# Altium schematic sheet Sheet1.SchDoc
size A3
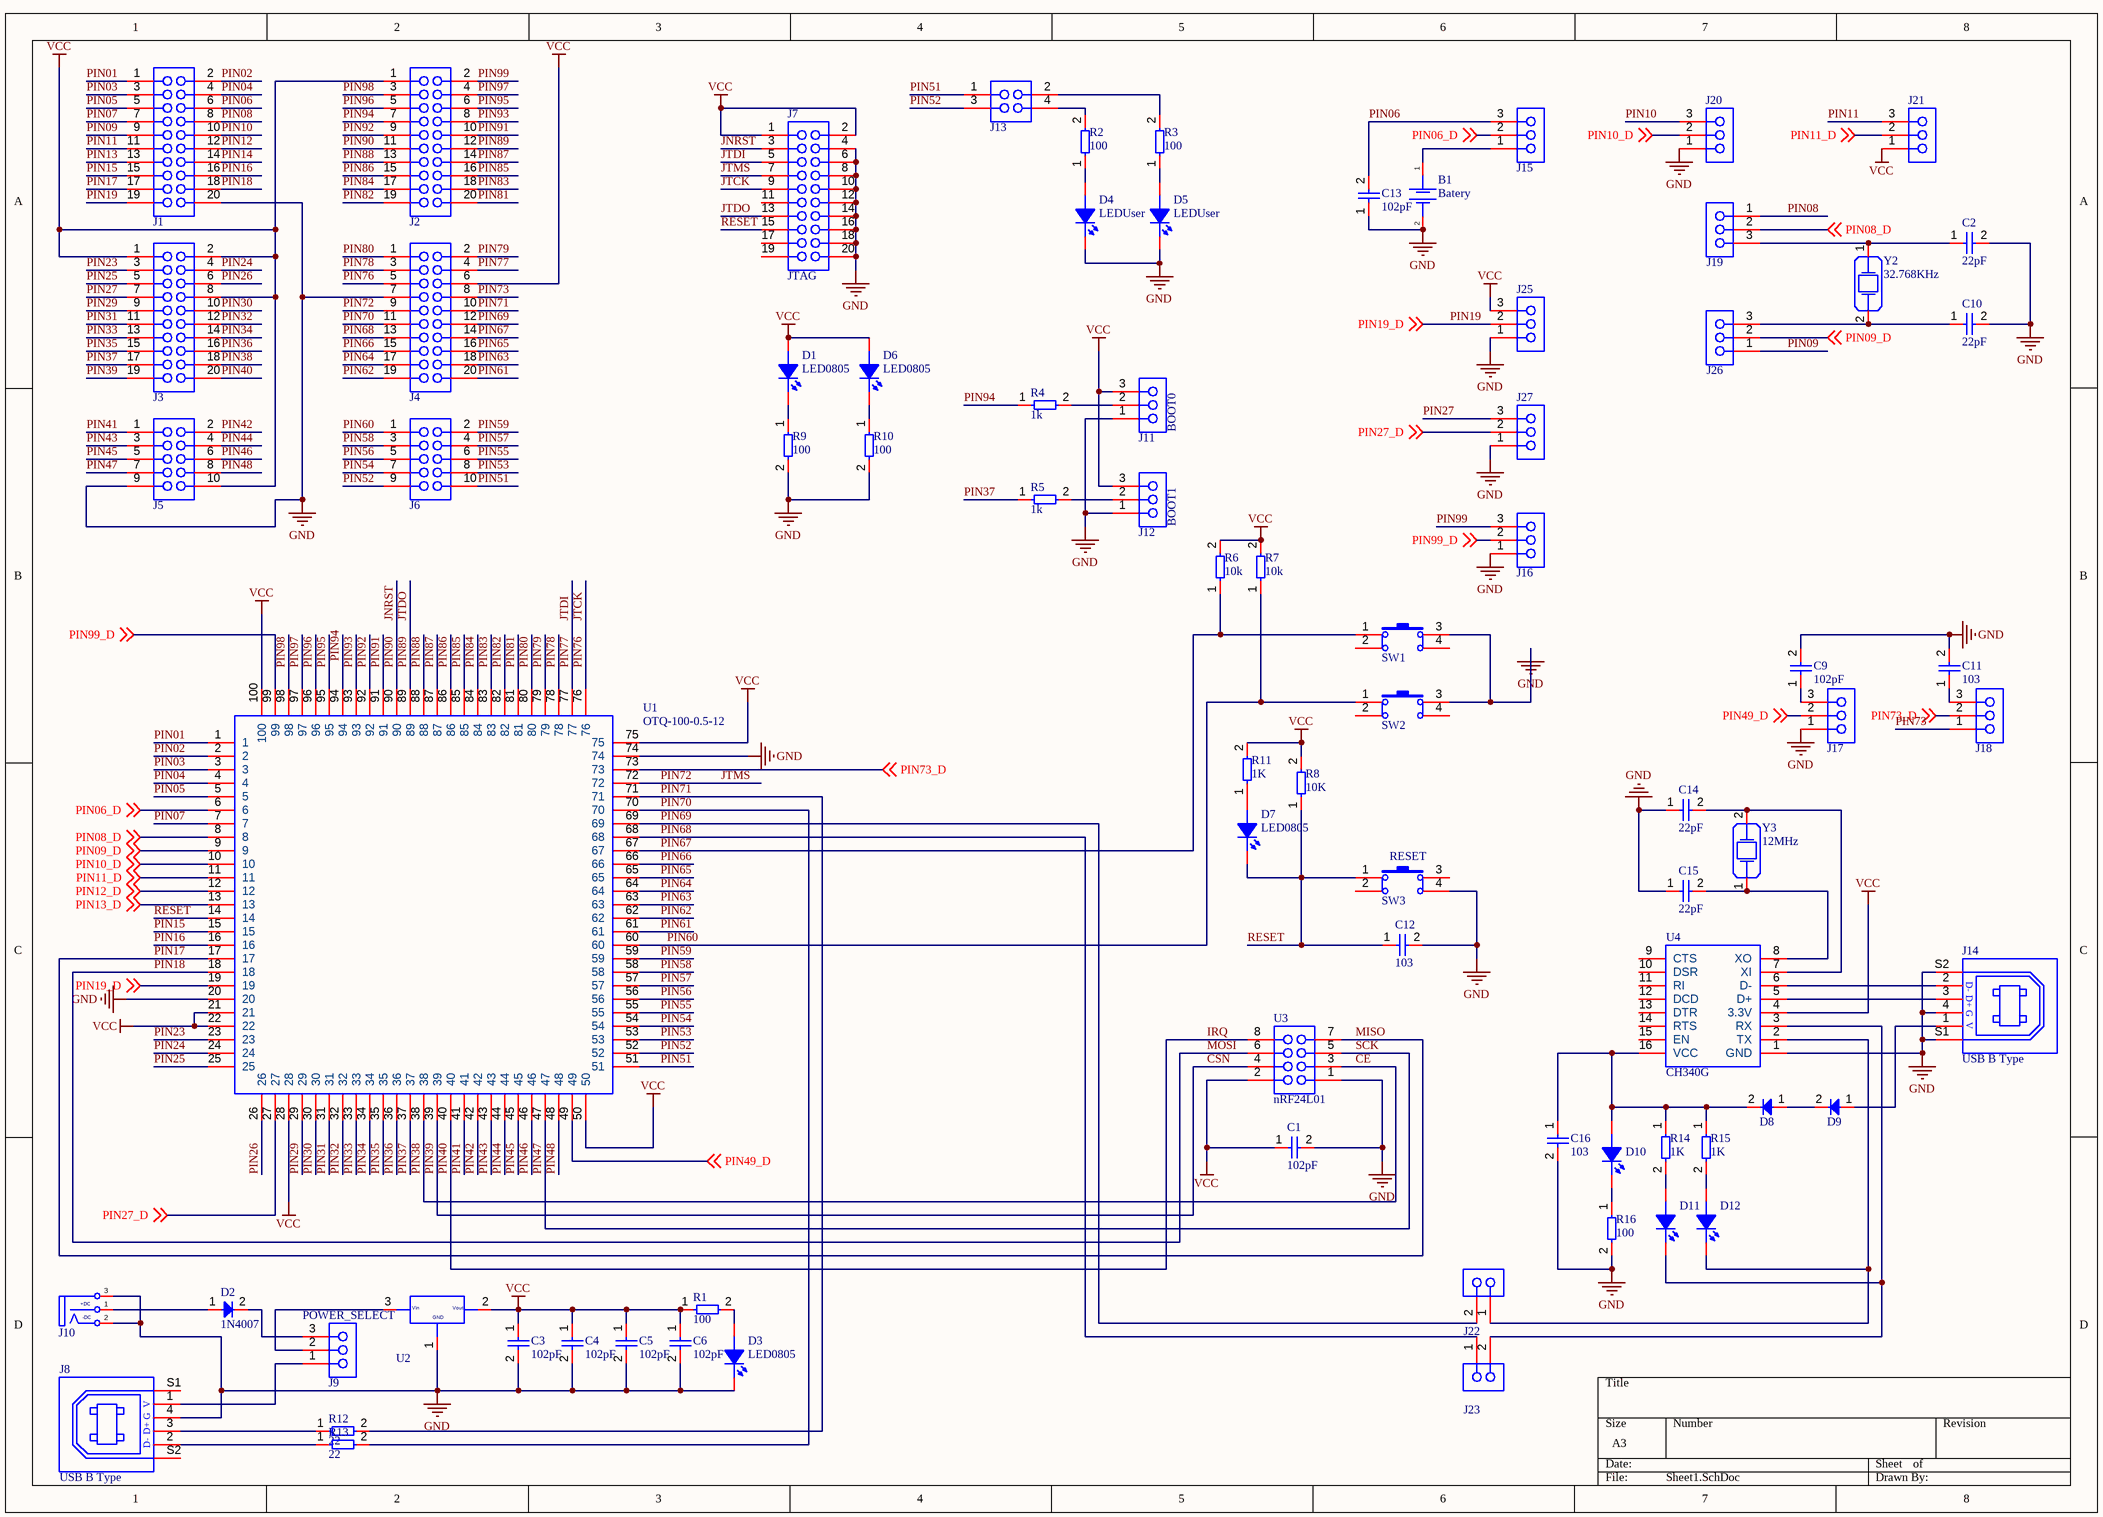
[diagram p0: Sheet1.SchDoc]

## Parts
B1  Batery  [CR1220]
C1  102pF  [C1206]
C2  22pF  [C0805]
C3  102pF  [C0805]
C4  102pF  [C0805]
C5  102pF  [C0805]
C6  102pF  [C0805]
C9  102pF  [C0805]
C10  22pF  [C0805]
C11  103  [C0805]
C12  103  [C0805]
C13  102pF  [C0805]
C14  22pF  [C0805]
C15  22pF  [C0805]
C16  103  [C0805]
D1  LED0805  [L0805RED]
D2  1N4007  [DO-41]
D3  LED0805  [L0805RED]
D4  LEDUser  [L0805RED]
D5  LEDUser  [L0805RED]
D6  LED0805  [L0805RED]
D7  LED0805  [L0805RED]
D8  1N4148  [SOD-80]  (value not drawn)
D9  1N4148  [SOD-80]  (value not drawn)
D10  LED0805  [L0805RED]  (value not drawn)
D11  LED0805  [L0805RED]  (value not drawn)
D12  LED0805  [L0805RED]  (value not drawn)
J1  Header 10x2 TH Pitch 2.54mm  [Header 10x2 TH Pitch 2.54mm]  (value not drawn)
J2  Header 10x2 TH Pitch 2.54mm  [Header 10x2 TH Pitch 2.54mm]  (value not drawn)
J3  Header 10x2 TH Pitch 2.54mm  [Header 10x2 TH Pitch 2.54mm]  (value not drawn)
J4  Header 10x2 TH Pitch 2.54mm  [Header 10x2 TH Pitch 2.54mm]  (value not drawn)
J5  Header 5x2 TH Pitch 2.54mm  [Header 5x2 TH Pitch 2.54mm]  (value not drawn)
J6  Header 5x2 TH Pitch 2.54mm  [Header 5x2 TH Pitch 2.54mm]  (value not drawn)
J7  JTAG  [IDC_CONNECTOR_20_2.54]
J8  USB B Type  [USB-B-TYPE]
J9  POWER_SELECT  [Header 3x1 TH Pitch 2.54mm]
J10  Connector  [DC_JACK_161-0721]  (value not drawn)
J11  BOOT0  [Header 3x1 TH Pitch 2.54mm]
J12  BOOT1  [Header 3x1 TH Pitch 2.54mm]
J13  Header 2x2 TH Pitch 2.54mm  [Header 2x2 TH Pitch 2.54mm]  (value not drawn)
J14  USB B Type  [USB-B-TYPE]
J15  Header 3x1 TH Pitch 2.54mm  [Header 3x1 TH Pitch 2.54mm]  (value not drawn)
J16  Header 3x1 TH Pitch 2.54mm  [Header 3x1 TH Pitch 2.54mm]  (value not drawn)
J17  Header 3x1 TH Pitch 2.54mm  [Header 3x1 TH Pitch 2.54mm]  (value not drawn)
J18  Header 3x1 TH Pitch 2.54mm  [Header 3x1 TH Pitch 2.54mm]  (value not drawn)
J19  Header 3x1 TH Pitch 2.54mm  [Header 3x1 TH Pitch 2.54mm]  (value not drawn)
J20  Header 3x1 TH Pitch 2.54mm  [Header 3x1 TH Pitch 2.54mm]  (value not drawn)
J21  Header 3x1 TH Pitch 2.54mm  [Header 3x1 TH Pitch 2.54mm]  (value not drawn)
J22  Header 2x1 TH Pitch 2.54mm  [Header 2x1 TH Pitch 2.54mm]  (value not drawn)
J23  Header 2x1 TH Pitch 2.54mm  [Header 2x1 TH Pitch 2.54mm]  (value not drawn)
J25  Header 3x1 TH Pitch 2.54mm  [Header 3x1 TH Pitch 2.54mm]  (value not drawn)
J26  Header 3x1 TH Pitch 2.54mm  [Header 3x1 TH Pitch 2.54mm]  (value not drawn)
J27  Header 3x1 TH Pitch 2.54mm  [Header 3x1 TH Pitch 2.54mm]  (value not drawn)
R1  100  [R0805]
R2  100  [R0805]
R3  100  [R0805]
R4  1k  [R0805]
R5  1k  [R0805]
R6  10k  [R0805]
R7  10k  [R0805]
R8  10K  [R0805]
R9  100  [R0805]
R10  100  [R0805]
R11  1K  [R0805]
R12  22  [R0805]
R13  22  [R0805]
R14  1K  [R0805]
R15  1K  [R0805]
R16  100  [R0805]
SW1  Button Hole  [BUTTON_HOLE_5.0mm]  (value not drawn)
SW2  Button Hole  [BUTTON_HOLE_5.0mm]  (value not drawn)
SW3  RESET  [BUTTON_HOLE_5.0mm]
U1  OTQ-100-0.5-12  [ENPLAS OTQ-100-0.5-12]
U2  AMS1117  [SOT223-3]  (value not drawn)
U3  nRF24L01  [nRF24L01]
U4  CH340G  [SOP16_1.27_3.8]
Y2  32.768KHz  [DT-26]
Y3  12MHz  [SMD5032]

## Nets
GND: B1.2 C1.2 C2.2 C3.2 C4.2 C5.2 C6.2 C9.2 C10.2 C11.2 C12.2 C13.1 C14.1 C15.1 C16.2 D3.2(K) D4.2(K) D5.2(K) J1.20 J4.7 J5.9 J7.4 J7.6 J7.8 J7.10 J7.12 J7.14 J7.16 J7.18 J7.20 J8.4 J10.2(DC-) J10.3(T) J11.1 J12.1 J14.4 J14.S1 J14.S2 J16.1 J17.1 J20.1 J25.1 J27.1 R9.2 R10.2 R16.2 SW1.3 SW2.3 SW3.4 U1.20 U1.74 U2.1 U3.1 U4.1(GND)
VCC: C1.1 C3.1 C4.1 C5.1 C6.1 D1.1(A) D6.1(A) J2.1 J3.1 J3.2 J3.8 J4.6 J5.10 J7.1 J7.2 J11.3 J12.3 J21.1 J25.3 R1.1 R6.2 R7.2 R8.2 R11.2 U1.21 U1.22 U1.28 U1.50 U1.75 U1.100 U2.2 U3.2 U4.4(3.3V)
CE: J3.18 U1.38 U3.3  [also labelled PIN38]
CSN: J3.19 U1.39 U3.4  [also labelled PIN39]
IRQ: J3.20 U1.40 U3.8  [also labelled PIN40]
JNRST: J2.11 J7.3 U1.90  [also labelled PIN90]
JTCK: J4.5 J7.9 U1.76  [also labelled PIN76]
JTDI: J4.4 J7.5 U1.77  [also labelled PIN77]
JTDO: J2.12 J7.13 U1.89  [also labelled PIN89]
JTMS: J4.9 J7.7 U1.72  [also labelled PIN72]
MISO: J1.17 U1.17 U3.7  [also labelled PIN17]
MOSI: J1.18 U1.18 U3.6  [also labelled PIN18]
PIN01: J1.1 U1.1
PIN02: J1.2 U1.2
PIN03: J1.3 U1.3
PIN04: J1.4 U1.4
PIN05: J1.5 U1.5
PIN06: C13.2 J1.6 J15.3
PIN06_D: J15.2 U1.6 ; off-sheet PIN06_D
PIN07: J1.7 U1.7
PIN08: J1.8 J19.1
PIN08_D: J19.2 U1.8 ; off-sheet PIN08_D
PIN09: J1.9 J26.1
PIN09_D: J26.2 U1.9 ; off-sheet PIN09_D
PIN10: J1.10 J20.3
PIN10_D: J20.2 U1.10 ; off-sheet PIN10_D
PIN11: J1.11 J21.3
PIN11_D: J21.2 U1.11 ; off-sheet PIN11_D
PIN12: J1.12
PIN12_D: U1.12 ; off-sheet PIN12_D
PIN13: J1.13
PIN13_D: U1.13 ; off-sheet PIN13_D
PIN14: J1.14
PIN15: J1.15 U1.15
PIN16: J1.16 U1.16
PIN19: J1.19 J25.2 U1.19 ; off-sheet PIN19_D  [also labelled PIN19_D]
PIN23: J3.3 U1.23
PIN24: J3.4 U1.24
PIN25: J3.5 U1.25
PIN26: J3.6 U1.26
PIN27: J3.7 J27.3
PIN27_D: J27.2 U1.27 ; off-sheet PIN27_D
PIN29: J3.9 U1.29
PIN30: J3.10 U1.30
PIN31: J3.11 U1.31
PIN32: J3.12 U1.32
PIN33: J3.13 U1.33
PIN34: J3.14 U1.34
PIN35: J3.15 U1.35
PIN36: J3.16 U1.36
PIN37: J3.17 R5.1 U1.37
PIN41: J5.1 U1.41
PIN42: J5.2 U1.42
PIN43: J5.3 U1.43
PIN44: J5.4 U1.44
PIN45: J5.5 U1.45
PIN46: J5.6 U1.46
PIN47: J5.7 U1.47 U3.5  [also labelled SCK]
PIN48: J5.8 U1.48
PIN49_D: J17.2 U1.49 ; off-sheet PIN49_D
PIN51: J6.10 J13.1 U1.51
PIN52: J6.9 J13.3 U1.52
PIN53: J6.8 U1.53
PIN54: J6.7 U1.54
PIN55: J6.6 U1.55
PIN56: J6.5 U1.56
PIN57: J6.4 U1.57
PIN58: J6.3 U1.58
PIN59: J6.2 U1.59
PIN60: J6.1 R7.1 SW2.1 U1.60
PIN61: J4.20 U1.61
PIN62: J4.19 U1.62
PIN63: J4.18 U1.63
PIN64: J4.17 U1.64
PIN65: J4.16 U1.65
PIN66: J4.15 U1.66
PIN67: J4.14 R6.1 SW1.1 U1.67
PIN68: J4.13 J23.1 U1.68
PIN69: J4.12 J22.2 U1.69
PIN70: J4.11 R13.2 U1.70
PIN71: J4.10 R12.2 U1.71
PIN73: J4.8 J18.1
PIN73_D: J18.2 U1.73 ; off-sheet PIN73_D
PIN78: J4.3 U1.78
PIN79: J4.2 U1.79
PIN80: J4.1 U1.80
PIN81: J2.20 U1.81
PIN82: J2.19 U1.82
PIN83: J2.18 U1.83
PIN84: J2.17 U1.84
PIN85: J2.16 U1.85
PIN86: J2.15 U1.86
PIN87: J2.14 U1.87
PIN88: J2.13 U1.88
PIN91: J2.10 U1.91
PIN92: J2.9 U1.92
PIN93: J2.8 U1.93
PIN94: J2.7 R4.1 U1.94
PIN95: J2.6 U1.95
PIN96: J2.5 U1.96
PIN97: J2.4 U1.97
PIN98: J2.3 U1.98
PIN99: J2.2 J16.3
PIN99_D: J16.2 U1.99 ; off-sheet PIN99_D
RESET: C12.1 D7.2(K) J7.15 R8.1 SW3.1 U1.14
NetB1_1: B1.1 J15.1
NetC2_1: C2.1 J19.3 Y2.1
NetC9_1: C9.1 J17.3
NetC10_1: C10.1 J26.3 Y2.2
NetC11_1: C11.1 J18.3
NetC14_2: C14.2 U4.7(XI) Y3.2
NetC15_2: C15.2 U4.8(XO) Y3.1
NetC16_1: C16.1 D8.2 D10.1(A) R14.1 R15.1 U4.16(VCC)
NetD1_2: D1.2(K) R9.1
NetD2_1: D2.1 J10.1(DS+)
NetD2_2: D2.2 J9.3
NetD3_1: D3.1(A) R1.2
NetD4_1: D4.1(A) R2.1
NetD5_1: D5.1(A) R3.1
NetD6_2: D6.2(K) R10.1
NetD7_1: D7.1(A) R11.1
NetD8_1: D8.1 D9.2
NetD9_1: D9.1 J14.1
NetD10_2: D10.2(K) R16.1
NetD11_1: D11.1(A) R14.2
NetD11_2: D11.2(K) J23.2 U4.3(RX)
NetD12_1: D12.1(A) R15.2
NetD12_2: D12.2(K) J22.1 U4.2(TX)
NetJ8_1: J8.1 J9.1
NetJ8_2: J8.2 R13.1
NetJ8_3: J8.3 R12.1
NetJ9_2: J9.2 U2.3
NetJ11_2: J11.2 R4.2
NetJ12_2: J12.2 R5.2
NetJ13_2: J13.2 R3.2
NetJ13_4: J13.4 R2.2
NetJ14_2: J14.2 U4.6(D-)
NetJ14_3: J14.3 U4.5(D+)

Not connected (* = marked no-connect by the designer): J7 11 17 19; J8 S1 S2; SW1 2 4; SW2 2 4; SW3 2 3; U4 9(CTS) 10(DSR) 11(RI) 12(DCD) 13(DTR) 14(RTS) 15(EN)

## Notes on the sheet
- (in symbol AMS1117(SOT-223)) Vin; Vout; GND
- (in symbol JackDC) +DC; -DC
- (in symbol USB B Type) D-; D+; G; V

## Library data of the parts
C1 C3-C6 C9 C13 = Capacitors(SMD)
C2 C10-C12 C14-C16 = C0805
D4 D5 = LED0805
D8 D9 = 1N4148 (SOD-80)
J7 = IDC_2.54_10x2
J9 J11 J12 = Header 3x1 TH Pitch 2.54mm
J10 = JackDC
R1-R3 R8 R14-R16 = R0805
R4-R7 R9-R13 = Resistor SMD
SW3 = Button Hole
U1 = ENPLAS OTQ-100-0.5-12
U2 = AMS1117(SOT-223)
Y2 = Crystal 32.768KHz
Y3 = Crystal